# EAGLE design arm-board-rev3 (EAGLE 6.5.0)

## Sheet 1 of 6: Processor
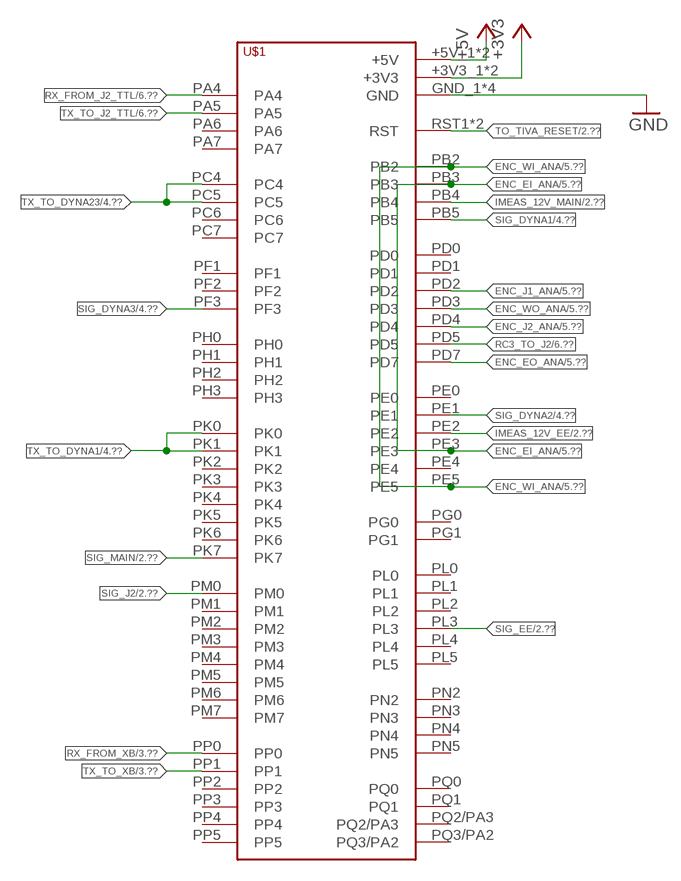
[diagram p0: schematic, sheet 1]

### Parts
U$1  TIVA-C-CONNECTED  [TIVA-C-CONNECTED]

### Nets
+3V3: U$1.+3V3_1(+3V3) U$1.+3V3_2(+3V3) ; also sheet 2,3,4,5
+5V: U$1.+5V_1(+5V) U$1.+5V_2(+5V) ; also sheet 2,5,6
ENC_EI_ANA: U$1.PB3 U$1.PE3 ; also sheet 5
ENC_EO_ANA: U$1.PD7 ; also sheet 5
ENC_J1_ANA: U$1.PD2 ; also sheet 5
ENC_J2_ANA: U$1.PD4 ; also sheet 5
ENC_WI_ANA: U$1.PB2 U$1.PE5 ; also sheet 5
ENC_WO_ANA: U$1.PD3 ; also sheet 5
GND: U$1.GND_1(GND) U$1.GND_2(GND) U$1.GND_3(GND) U$1.GND_4(GND) ; also sheet 2,3,4,5,6
IMEAS_12V_EE: U$1.PE2 ; also sheet 2
IMEAS_12V_MAIN: U$1.PB4 ; also sheet 2
RC3_TO_J2: U$1.PD5 ; also sheet 6
RX_FROM_J2_TTL: U$1.PA4 ; also sheet 6
RX_FROM_XB: U$1.PP0 ; also sheet 3
SIG_DYNA1: U$1.PB5 ; also sheet 4
SIG_DYNA2: U$1.PE1 ; also sheet 4
SIG_DYNA3: U$1.PF3 ; also sheet 4
SIG_EE: U$1.PL3 ; also sheet 2
SIG_J2: U$1.PM0 ; also sheet 2
SIG_MAIN: U$1.PK7 ; also sheet 2
TO_TIVA_RESET: U$1.RST1(RST) U$1.RST_2(RST) ; also sheet 2
TX_TO_DYNA1: U$1.PK0 U$1.PK1 ; also sheet 4
TX_TO_DYNA23: U$1.PC4 U$1.PC5 ; also sheet 4
TX_TO_J2_TTL: U$1.PA5 ; also sheet 6
TX_TO_XB: U$1.PP1 ; also sheet 3
Unconnected: U$1.PA6 U$1.PA7 U$1.PC6 U$1.PC7 U$1.PD0 U$1.PD1 U$1.PE0 U$1.PE4 U$1.PF1 U$1.PF2 U$1.PG0 U$1.PG1 U$1.PH0 U$1.PH1 U$1.PH2 U$1.PH3 U$1.PK2 U$1.PK3 U$1.PK4 U$1.PK5 U$1.PK6 U$1.PL0 U$1.PL1 U$1.PL2 U$1.PL4 U$1.PL5 U$1.PM1 U$1.PM2 U$1.PM3 U$1.PM4 U$1.PM5 U$1.PM6 U$1.PM7 U$1.PN2 U$1.PN3 U$1.PN4 U$1.PN5 U$1.PP2 U$1.PP3 U$1.PP4 U$1.PP5 U$1.PQ0 U$1.PQ1 U$1.PQ2/PA3 U$1.PQ3/PA2

## Sheet 2 of 6: Power
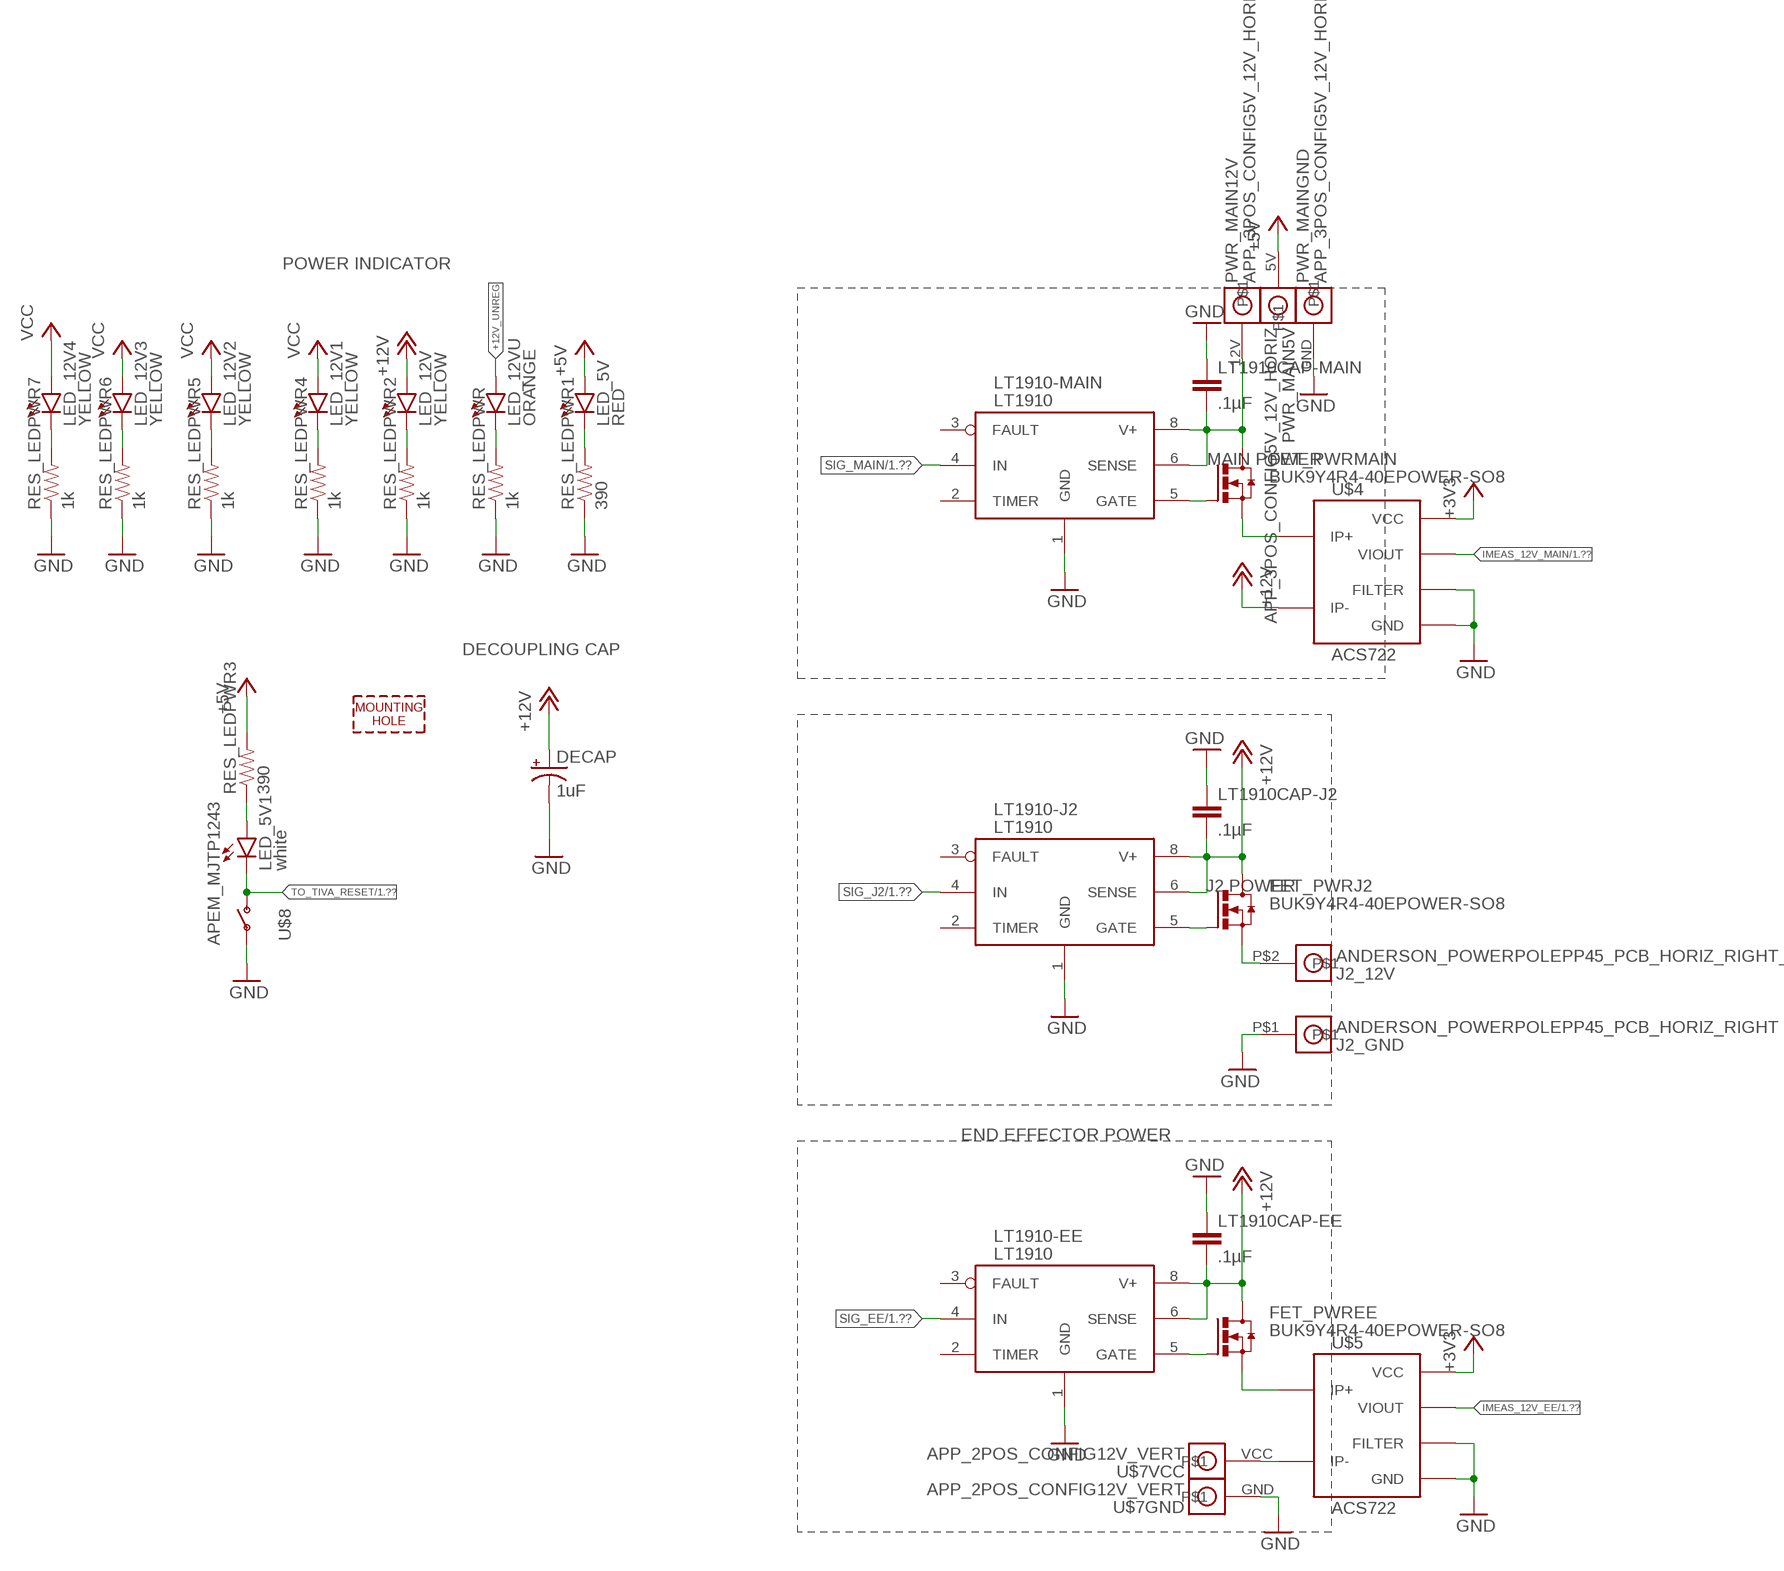
[diagram p1: schematic, sheet 2]

### Parts
DECAP  1uF  100UF-25V-20%(PTH)  [CPOL-RADIAL-100UF-25V]
FET_PWREE  BUK9Y4R4-40EPOWER-SO8  [POWER-SO8]
FET_PWRJ2  BUK9Y4R4-40EPOWER-SO8  [POWER-SO8]
FET_PWRMAIN  BUK9Y4R4-40EPOWER-SO8  [POWER-SO8]
J2_12V  ANDERSON_POWERPOLEPP45_PCB_HORIZ_RIGHT_2HIGH  [APP45_PCB_HORIZ_RIGHT_2HIGH]
J2_GND  ANDERSON_POWERPOLEPP45_PCB_HORIZ_RIGHT  [APP45_PCB_HORIZ_RIGHT]
LED_5V  RED  LED0603  [LED-0603]
LED_5V1  white  LED1206  [LED-1206]
LED_12V  YELLOW  LED0603  [LED-0603]
LED_12V1  YELLOW  LED0603  [LED-0603]
LED_12V2  YELLOW  LED0603  [LED-0603]
LED_12V3  YELLOW  LED0603  [LED-0603]
LED_12V4  YELLOW  LED0603  [LED-0603]
LED_12VU  ORANGE  LED0603  [LED-0603]
LT1910-EE  LT1910  [SO8]
LT1910-J2  LT1910  [SO8]
LT1910-MAIN  LT1910  [SO8]
LT1910CAP-EE  .1µF  CAP0603-CAP  [0603-CAP]
LT1910CAP-J2  .1µF  CAP0603-CAP  [0603-CAP]
LT1910CAP-MAIN  .1µF  CAP0603-CAP  [0603-CAP]
PWR_MAIN  APP_3POS_CONFIG5V_12V_HORIZ  [APP45_5V_12V_HORIZ_CONFIG]
RES_LEDPWR  1k  RESISTOR0603  [0603-RES]
RES_LEDPWR1  390  RESISTOR0603  [0603-RES]
RES_LEDPWR2  1k  RESISTOR0603  [0603-RES]
RES_LEDPWR3  390  RESISTOR0603  [0603-RES]
RES_LEDPWR4  1k  RESISTOR0603  [0603-RES]
RES_LEDPWR5  1k  RESISTOR0603  [0603-RES]
RES_LEDPWR6  1k  RESISTOR0603  [0603-RES]
RES_LEDPWR7  1k  RESISTOR0603  [0603-RES]
U$3  MOUNTING_HOLE#6  [#6_SCREW]
U$4  ACS722  [SO-08]
U$5  ACS722  [SO-08]
U$7  APP_2POS_CONFIG12V_VERT  [APP45_12V_VERT_CONFIG]
U$8  APEM_MJTP1243  [APEM_MJTP1243]

### Nets
+3V3: U$4.8(VCC) U$5.8(VCC) ; also sheet 1,3,4,5
+5V: LED_5V.A PWR_MAIN.5V RES_LEDPWR3.2 ; also sheet 1,5,6
+12V: DECAP.1(+) FET_PWREE.5(D) FET_PWREE.6(D) FET_PWREE.7(D) FET_PWREE.8(D) FET_PWRJ2.5(D) FET_PWRJ2.6(D) FET_PWRJ2.7(D) FET_PWRJ2.8(D) LED_12V.A LT1910-EE.6(SENSE) LT1910-EE.8(V+) LT1910-J2.6(SENSE) LT1910-J2.8(V+) LT1910CAP-EE.2 LT1910CAP-J2.2 U$4.3(IP-) U$4.4(IP-) ; also sheet 4
+12V_UNREG: FET_PWRMAIN.5(D) FET_PWRMAIN.6(D) FET_PWRMAIN.7(D) FET_PWRMAIN.8(D) LED_12VU.A LT1910-MAIN.6(SENSE) LT1910-MAIN.8(V+) LT1910CAP-MAIN.2 PWR_MAIN.12V
GATE-EE: FET_PWREE.4(G) LT1910-EE.5(GATE)
GATE-J2: FET_PWRJ2.4(G) LT1910-J2.5(GATE)
GATE-MAIN: FET_PWRMAIN.4(G) LT1910-MAIN.5(GATE)
GND: DECAP.2(-) J2_GND.P$1 LT1910-EE.1(GND) LT1910-J2.1(GND) LT1910-MAIN.1(GND) LT1910CAP-EE.1 LT1910CAP-J2.1 LT1910CAP-MAIN.1 PWR_MAIN.GND RES_LEDPWR1.1 RES_LEDPWR2.1 RES_LEDPWR4.1 RES_LEDPWR5.1 RES_LEDPWR6.1 RES_LEDPWR7.1 RES_LEDPWR.1 U$4.5(GND) U$4.6(FILTER) U$5.5(GND) U$5.6(FILTER) U$7.GND U$8.P$1(P) ; also sheet 1,3,4,5,6
IMEAS_12V_EE: U$5.7(VIOUT) ; also sheet 1
IMEAS_12V_MAIN: U$4.7(VIOUT) ; also sheet 1
N$4: LED_12V.C RES_LEDPWR2.2
N$5: LED_12VU.C RES_LEDPWR.2
N$6: LED_5V.C RES_LEDPWR1.2
N$7: LED_12V1.C RES_LEDPWR4.2
N$10: U$5.3(IP-) U$5.4(IP-) U$7.VCC
N$11: LED_5V1.A RES_LEDPWR3.1
N$12: LED_12V2.C RES_LEDPWR5.2
N$14: LED_12V3.C RES_LEDPWR6.2
N$15: LED_12V4.C RES_LEDPWR7.2
SIG_EE: LT1910-EE.4(IN) ; also sheet 1
SIG_J2: LT1910-J2.4(IN) ; also sheet 1
SIG_MAIN: LT1910-MAIN.4(IN) ; also sheet 1
SOURCE-DYNA1: LED_12V2.A ; supply symbol labelled VCC ; also sheet 4
SOURCE-DYNA2: LED_12V3.A ; supply symbol labelled VCC ; also sheet 4
SOURCE-DYNA3: LED_12V4.A ; supply symbol labelled VCC ; also sheet 4
SOURCE-EE: FET_PWREE.1(S) FET_PWREE.2(S) FET_PWREE.3(S) U$5.1(IP+) U$5.2(IP+)
SOURCE-J2: FET_PWRJ2.1(S) FET_PWRJ2.2(S) FET_PWRJ2.3(S) J2_12V.P$2 LED_12V1.A ; supply symbol labelled VCC
SOURCE-MAIN: FET_PWRMAIN.1(S) FET_PWRMAIN.2(S) FET_PWRMAIN.3(S) U$4.1(IP+) U$4.2(IP+)
TO_TIVA_RESET: LED_5V1.C U$8.P$2(S) ; also sheet 1
Unconnected: LT1910-EE.2(TIMER) LT1910-EE.3(FAULT) LT1910-J2.2(TIMER) LT1910-J2.3(FAULT) LT1910-MAIN.2(TIMER) LT1910-MAIN.3(FAULT)

### Notes on the sheet
- POWER INDICATOR
- MAIN POWER
- DECOUPLING CAP
- J2 POWER
- END EFFECTOR POWER

## Sheet 3 of 6: Xbee
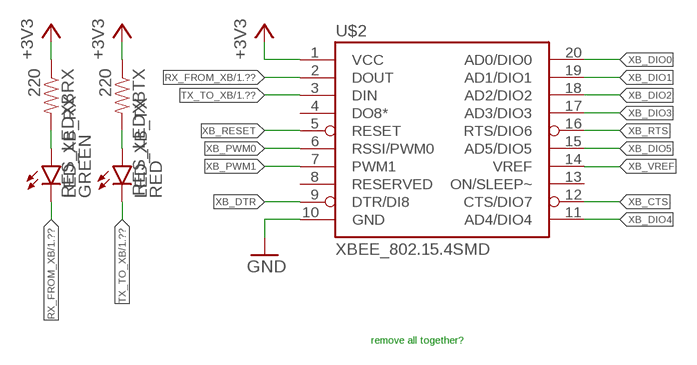
[diagram p2: schematic, sheet 3]

### Parts
LED_XB_RX  GREEN  LED0603  [LED-0603]
LED_XB_TX  RED  LED0603  [LED-0603]
RES_LEDXBRX  220  RESISTOR0603  [0603-RES]
RES_LEDXBTX  220  RESISTOR0603  [0603-RES]
U$2  XBEE_802.15.4SMD  [XBEE_802.15.4_SMD]

### Nets
+3V3: RES_LEDXBRX.1 RES_LEDXBTX.1 U$2.1(VCC) ; also sheet 1,2,4,5
GND: U$2.10(GND) ; also sheet 1,2,4,5,6
N$1: LED_XB_RX.A RES_LEDXBRX.2
N$2: LED_XB_TX.A RES_LEDXBTX.2
RX_FROM_XB: LED_XB_RX.C U$2.2(DOUT) ; also sheet 1
TX_TO_XB: LED_XB_TX.C U$2.3(DIN) ; also sheet 1
XB_CTS: U$2.12(CTS/DIO7)
XB_DIO0: U$2.20(AD0/DIO0)
XB_DIO1: U$2.19(AD1/DIO1)
XB_DIO2: U$2.18(AD2/DIO2)
XB_DIO3: U$2.17(AD3/DIO3)
XB_DIO4: U$2.11(AD4/DIO4)
XB_DIO5: U$2.15(AD5/DIO5)
XB_DTR: U$2.9(DTR/DI8)
XB_PWM0: U$2.6(RSSI/PWM0)
XB_PWM1: U$2.7(PWM1)
XB_RESET: U$2.5(RESET)
XB_RTS: U$2.16(RTS/DIO6)
XB_VREF: U$2.14(VREF)
Unconnected: U$2.4(DO8*) U$2.8(RESERVED) U$2.13(ON/SLEEP~)

### Notes on the sheet
- remove all together?

## Sheet 4 of 6: Dynamixels
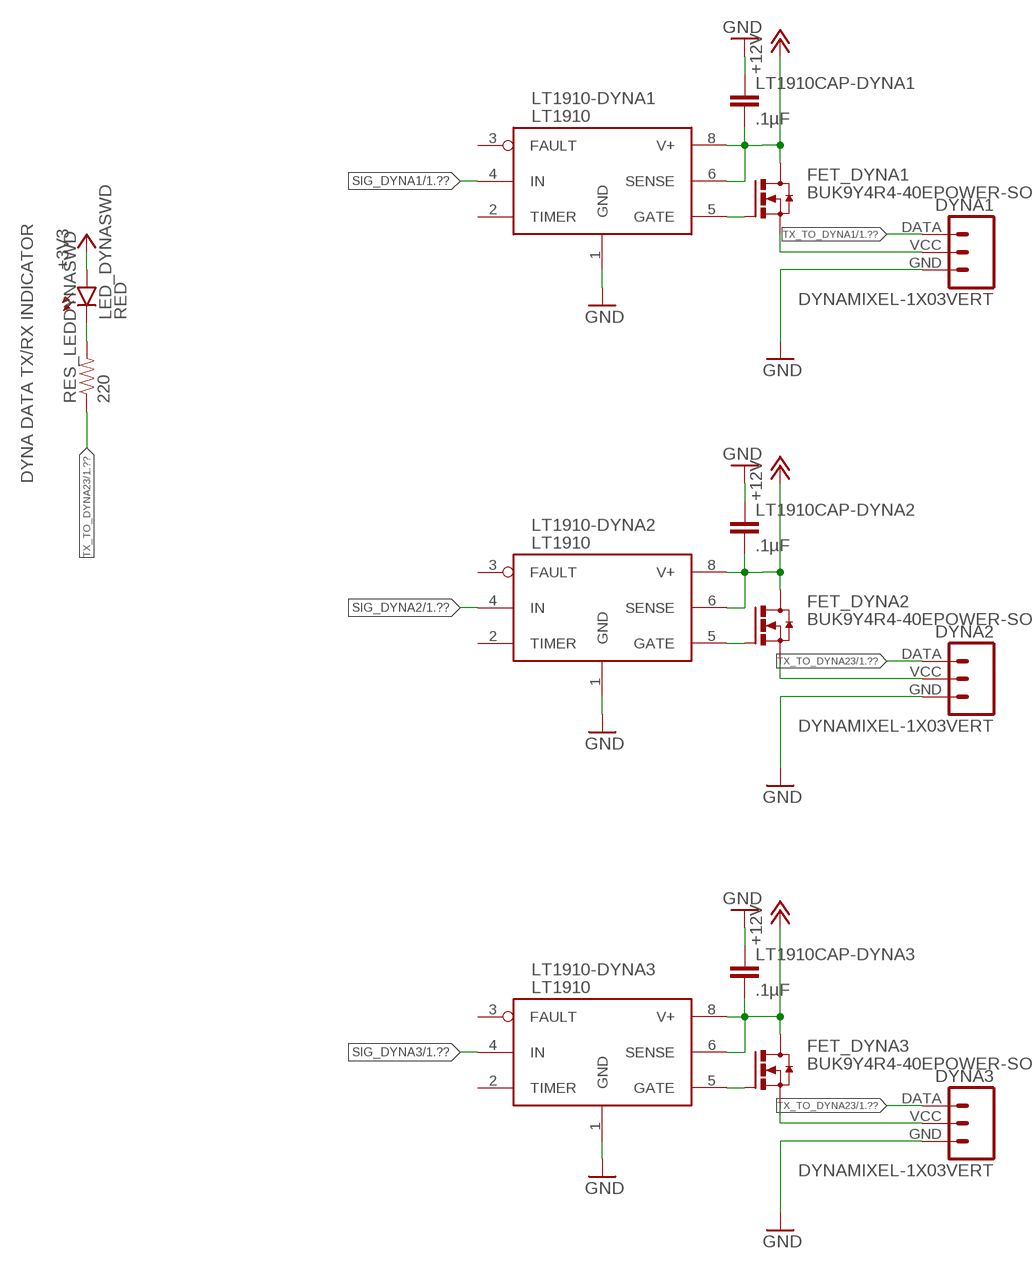
[diagram p3: schematic, sheet 4]

### Parts
DYNA1  DYNAMIXEL-1X03VERT  [MLX-SPOX5267-3PIN]
DYNA2  DYNAMIXEL-1X03VERT  [MLX-SPOX5267-3PIN]
DYNA3  DYNAMIXEL-1X03VERT  [MLX-SPOX5267-3PIN]
FET_DYNA1  BUK9Y4R4-40EPOWER-SO8  [POWER-SO8]
FET_DYNA2  BUK9Y4R4-40EPOWER-SO8  [POWER-SO8]
FET_DYNA3  BUK9Y4R4-40EPOWER-SO8  [POWER-SO8]
LED_DYNASWD  RED  LED0603  [LED-0603]
LT1910-DYNA1  LT1910  [SO8]
LT1910-DYNA2  LT1910  [SO8]
LT1910-DYNA3  LT1910  [SO8]
LT1910CAP-DYNA1  .1µF  CAP0603-CAP  [0603-CAP]
LT1910CAP-DYNA2  .1µF  CAP0603-CAP  [0603-CAP]
LT1910CAP-DYNA3  .1µF  CAP0603-CAP  [0603-CAP]
RES_LEDDYNASWD  220  RESISTOR0603  [0603-RES]

### Nets
+3V3: LED_DYNASWD.A ; also sheet 1,2,3,5
+12V: FET_DYNA1.5(D) FET_DYNA1.6(D) FET_DYNA1.7(D) FET_DYNA1.8(D) FET_DYNA2.5(D) FET_DYNA2.6(D) FET_DYNA2.7(D) FET_DYNA2.8(D) FET_DYNA3.5(D) FET_DYNA3.6(D) FET_DYNA3.7(D) FET_DYNA3.8(D) LT1910-DYNA1.6(SENSE) LT1910-DYNA1.8(V+) LT1910-DYNA2.6(SENSE) LT1910-DYNA2.8(V+) LT1910-DYNA3.6(SENSE) LT1910-DYNA3.8(V+) LT1910CAP-DYNA1.2 LT1910CAP-DYNA2.2 LT1910CAP-DYNA3.2 ; also sheet 2
GATE-DYNA1: FET_DYNA1.4(G) LT1910-DYNA1.5(GATE)
GATE-DYNA2: FET_DYNA2.4(G) LT1910-DYNA2.5(GATE)
GATE-DYNA3: FET_DYNA3.4(G) LT1910-DYNA3.5(GATE)
GND: DYNA1.GND DYNA2.GND DYNA3.GND LT1910-DYNA1.1(GND) LT1910-DYNA2.1(GND) LT1910-DYNA3.1(GND) LT1910CAP-DYNA1.1 LT1910CAP-DYNA2.1 LT1910CAP-DYNA3.1 ; also sheet 1,2,3,5,6
N$3: LED_DYNASWD.C RES_LEDDYNASWD.2
SIG_DYNA1: LT1910-DYNA1.4(IN) ; also sheet 1
SIG_DYNA2: LT1910-DYNA2.4(IN) ; also sheet 1
SIG_DYNA3: LT1910-DYNA3.4(IN) ; also sheet 1
SOURCE-DYNA1: DYNA1.VCC FET_DYNA1.1(S) FET_DYNA1.2(S) FET_DYNA1.3(S) ; also sheet 2
SOURCE-DYNA2: DYNA2.VCC FET_DYNA2.1(S) FET_DYNA2.2(S) FET_DYNA2.3(S) ; also sheet 2
SOURCE-DYNA3: DYNA3.VCC FET_DYNA3.1(S) FET_DYNA3.2(S) FET_DYNA3.3(S) ; also sheet 2
TX_TO_DYNA1: DYNA1.DATA ; also sheet 1
TX_TO_DYNA23: DYNA2.DATA DYNA3.DATA RES_LEDDYNASWD.1 ; also sheet 1
Unconnected: LT1910-DYNA1.2(TIMER) LT1910-DYNA1.3(FAULT) LT1910-DYNA2.2(TIMER) LT1910-DYNA2.3(FAULT) LT1910-DYNA3.2(TIMER) LT1910-DYNA3.3(FAULT)

### Notes on the sheet
- DYNA DATA TX/RX INDICATOR

## Sheet 5 of 6: Encoders
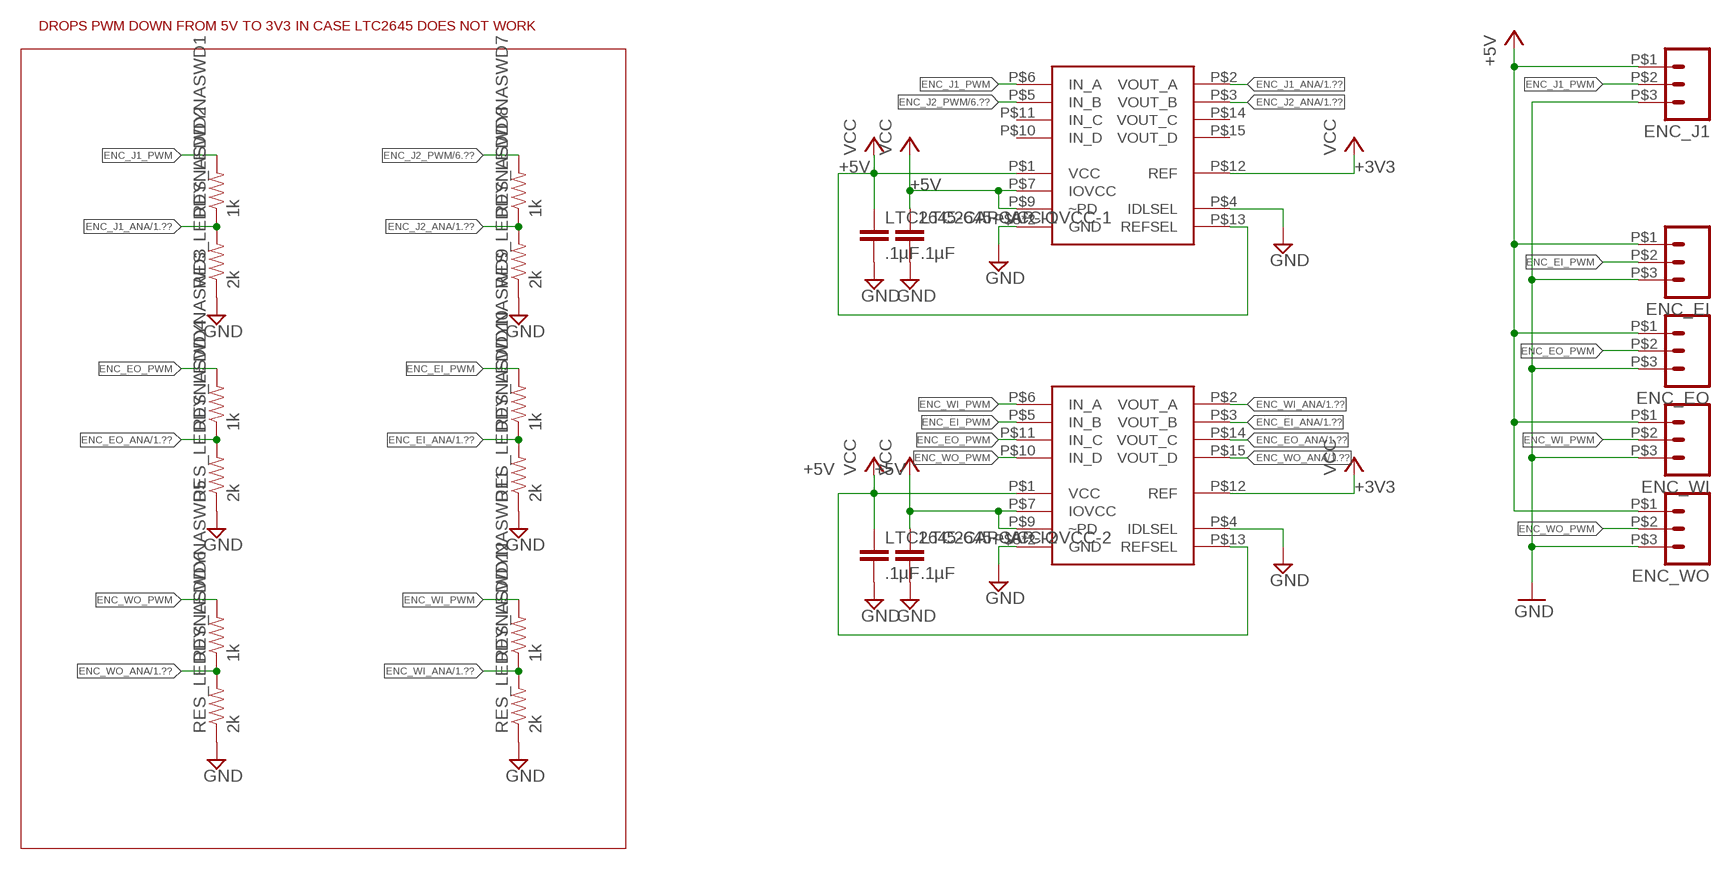
[diagram p4: schematic, sheet 5]

### Parts
ENC_EI  M03VERT  [MOLEX0436500328]
ENC_EO  M03VERT  [MOLEX0436500328]
ENC_J1  M03VERT  [MOLEX0436500328]
ENC_WI  M03VERT  [MOLEX0436500328]
ENC_WO  M03VERT  [MOLEX0436500328]
LTC2645-CAP-IOVCC-1  .1µF  CAP0603-CAP  [0603-CAP]
LTC2645-CAP-IOVCC-2  .1µF  CAP0603-CAP  [0603-CAP]
LTC2645-CAP-VCC-1  .1µF  CAP0603-CAP  [0603-CAP]
LTC2645-CAP-VCC-2  .1µF  CAP0603-CAP  [0603-CAP]
RES_LEDDYNASWD1  1k  RESISTOR0603  [0603-RES]
RES_LEDDYNASWD2  2k  RESISTOR0603  [0603-RES]
RES_LEDDYNASWD3  1k  RESISTOR0603  [0603-RES]
RES_LEDDYNASWD4  2k  RESISTOR0603  [0603-RES]
RES_LEDDYNASWD5  1k  RESISTOR0603  [0603-RES]
RES_LEDDYNASWD6  2k  RESISTOR0603  [0603-RES]
RES_LEDDYNASWD7  1k  RESISTOR0603  [0603-RES]
RES_LEDDYNASWD8  2k  RESISTOR0603  [0603-RES]
RES_LEDDYNASWD9  1k  RESISTOR0603  [0603-RES]
RES_LEDDYNASWD10  2k  RESISTOR0603  [0603-RES]
RES_LEDDYNASWD11  1k  RESISTOR0603  [0603-RES]
RES_LEDDYNASWD12  2k  RESISTOR0603  [0603-RES]
U$9  LTC2645  [MSOP16]
U$11  LTC2645  [MSOP16]

### Nets
+3V3: U$9.P$12(REF) U$11.P$12(REF) ; supply symbol labelled VCC ; also sheet 1,2,3,4
+5V: ENC_EI.P$1 ENC_EO.P$1 ENC_J1.P$1 ENC_WI.P$1 ENC_WO.P$1 LTC2645-CAP-IOVCC-1.1 LTC2645-CAP-IOVCC-2.1 LTC2645-CAP-VCC-1.1 LTC2645-CAP-VCC-2.1 U$9.P$1(VCC) U$9.P$7(IOVCC) U$9.P$9(~PD) U$9.P$13(REFSEL) U$11.P$1(VCC) U$11.P$7(IOVCC) U$11.P$9(~PD) U$11.P$13(REFSEL) ; supply symbol labelled VCC ; also sheet 1,2,6
ENC_EI_ANA: RES_LEDDYNASWD9.1 RES_LEDDYNASWD10.2 U$11.P$3(VOUT_B) ; also sheet 1
ENC_EI_PWM: ENC_EI.P$2 RES_LEDDYNASWD9.2 U$11.P$5(IN_B)
ENC_EO_ANA: RES_LEDDYNASWD3.1 RES_LEDDYNASWD4.2 U$11.P$14(VOUT_C) ; also sheet 1
ENC_EO_PWM: ENC_EO.P$2 RES_LEDDYNASWD3.2 U$11.P$11(IN_C)
ENC_J1_ANA: RES_LEDDYNASWD1.1 RES_LEDDYNASWD2.2 U$9.P$2(VOUT_A) ; also sheet 1
ENC_J1_PWM: ENC_J1.P$2 RES_LEDDYNASWD1.2 U$9.P$6(IN_A)
ENC_J2_ANA: RES_LEDDYNASWD7.1 RES_LEDDYNASWD8.2 U$9.P$3(VOUT_B) ; also sheet 1
ENC_J2_PWM: RES_LEDDYNASWD7.2 U$9.P$5(IN_B) ; also sheet 6
ENC_WI_ANA: RES_LEDDYNASWD11.1 RES_LEDDYNASWD12.2 U$11.P$2(VOUT_A) ; also sheet 1
ENC_WI_PWM: ENC_WI.P$2 RES_LEDDYNASWD11.2 U$11.P$6(IN_A)
ENC_WO_ANA: RES_LEDDYNASWD5.1 RES_LEDDYNASWD6.2 U$11.P$15(VOUT_D) ; also sheet 1
ENC_WO_PWM: ENC_WO.P$2 RES_LEDDYNASWD5.2 U$11.P$10(IN_D)
GND: ENC_EI.P$3 ENC_EO.P$3 ENC_J1.P$3 ENC_WI.P$3 ENC_WO.P$3 LTC2645-CAP-IOVCC-1.2 LTC2645-CAP-IOVCC-2.2 LTC2645-CAP-VCC-1.2 LTC2645-CAP-VCC-2.2 RES_LEDDYNASWD2.1 RES_LEDDYNASWD4.1 RES_LEDDYNASWD6.1 RES_LEDDYNASWD8.1 RES_LEDDYNASWD10.1 RES_LEDDYNASWD12.1 U$9.P$4(IDLSEL) U$9.P$8(GND) U$9.P$16(GND) U$11.P$4(IDLSEL) U$11.P$8(GND) U$11.P$16(GND) ; also sheet 1,2,3,4,6
Unconnected: U$9.P$10(IN_D) U$9.P$11(IN_C) U$9.P$14(VOUT_C) U$9.P$15(VOUT_D)

### Notes on the sheet
- DROPS PWM DOWN FROM 5V TO 3V3 IN CASE LTC2645 DOES NOT WORK

## Sheet 6 of 6: J2
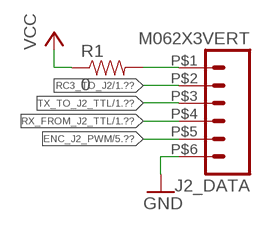
[diagram p5: schematic, sheet 6]

### Parts
J2_DATA  M062X3VERT  [MOLEX_0430450627]
R1  0  RESISTOR0603  [0603-RES]

### Nets
+5V: R1.1 ; supply symbol labelled VCC ; also sheet 1,2,5
ENC_J2_PWM: J2_DATA.P$5 ; also sheet 5
GND: J2_DATA.P$6 ; also sheet 1,2,3,4,5
N$13: J2_DATA.P$1 R1.2
RC3_TO_J2: J2_DATA.P$2 ; also sheet 1
RX_FROM_J2_TTL: J2_DATA.P$4 ; also sheet 1
TX_TO_J2_TTL: J2_DATA.P$3 ; also sheet 1

## Library data of the parts
DECAP = SparkFun-Capacitors:100UF-25V-20%(PTH): CAP-08439; PROD_ID: CAP-08439
DYNA1-DYNA3 = MRDT-2015-Arm:DYNAMIXEL-1X03; MFR: Molex; MFR_PN: 0022035035; ORIENT: Vert
ENC_EI ENC_EO ENC_J1 ENC_WI ENC_WO = MRDT-Connectors:M03
FET_DYNA1-FET_DYNA3 FET_PWREE FET_PWRJ2 FET_PWRMAIN = MRDT-2015-General:BUK9Y4R4-40E: Compatible with the BUK9Y** MOSFETS made by NXP Semiconductors.; MFR: NXP; MFR_PN: BUK9Y4R4-40E; PACKAGE: POWER-SO8
J2_12V J2_GND = MRDT-Connectors:ANDERSON_POWERPOLE: http://www.powerwerx.com/anderson-powerpoles/
J2_DATA = MRDT-Connectors:M06
LED_5V LED_5V1 LED_12V LED_12V1-LED_12V4 LED_12VU LED_DYNASWD LED_XB_RX LED_XB_TX = SparkFun-LED:LED: LEDs Standard schematic elements and footprints for 5mm, 3mm, 1206, and 0603 sized LEDs. 5mm - Spark Fun Electronics SKU : COM-00529 (and others)
LT1910-DYNA1-LT1910-DYNA3 LT1910-EE LT1910-J2 LT1910-MAIN = Jake:LT1910
LT1910CAP-DYNA1-LT1910CAP-DYNA3 LT1910CAP-EE LT1910CAP-J2 LT1910CAP-MAIN LTC2645-CAP-IOVCC-1 LTC2645-CAP-IOVCC-2 LTC2645-CAP-VCC-1 LTC2645-CAP-VCC-2 = SparkFun-Capacitors:CAP: Capacitor Standard 0603 ceramic capacitor, and 0.1" leaded capacitor.
PWR_MAIN = MRDT-Connectors:APP_3POS_CONFIG; COLOR1: YELLOW; COLOR2: RED; COLOR3: BLACK
R1 RES_LEDDYNASWD RES_LEDDYNASWD1-RES_LEDDYNASWD12 RES_LEDPWR RES_LEDPWR1-RES_LEDPWR7 RES_LEDXBRX RES_LEDXBTX = SparkFun-Resistors:RESISTOR: Resistor Basic schematic elements and footprints for 0603, 1206, and PTH resistors.
U$1 = MRDT-2015-General:TIVA-C-CONNECTED: TIVA C CONNECTED LAUNCHPAD
U$2 = MRDT-RF:XBEE_802.15.4
U$3 = MRDT-Hardware:MOUNTING_HOLE: Mounting hole for M6 bolt. Standard use mounting hole for: Tiva C Connected - M6 Anderson Powerpole Mounting Wing - M8 Most frame-mounted PCB's - M8
U$4 U$5 = MRDT-PowerICs:ACS722
U$7 = MRDT-Connectors:APP_2POS_CONFIG; COLOR1: YELLOW; COLOR2: BLACK
U$8 = MRDT-Electromechanical:APEM_MJTP1243
U$9 U$11 = MRDT-DigitalICs:LTC2645

## Board
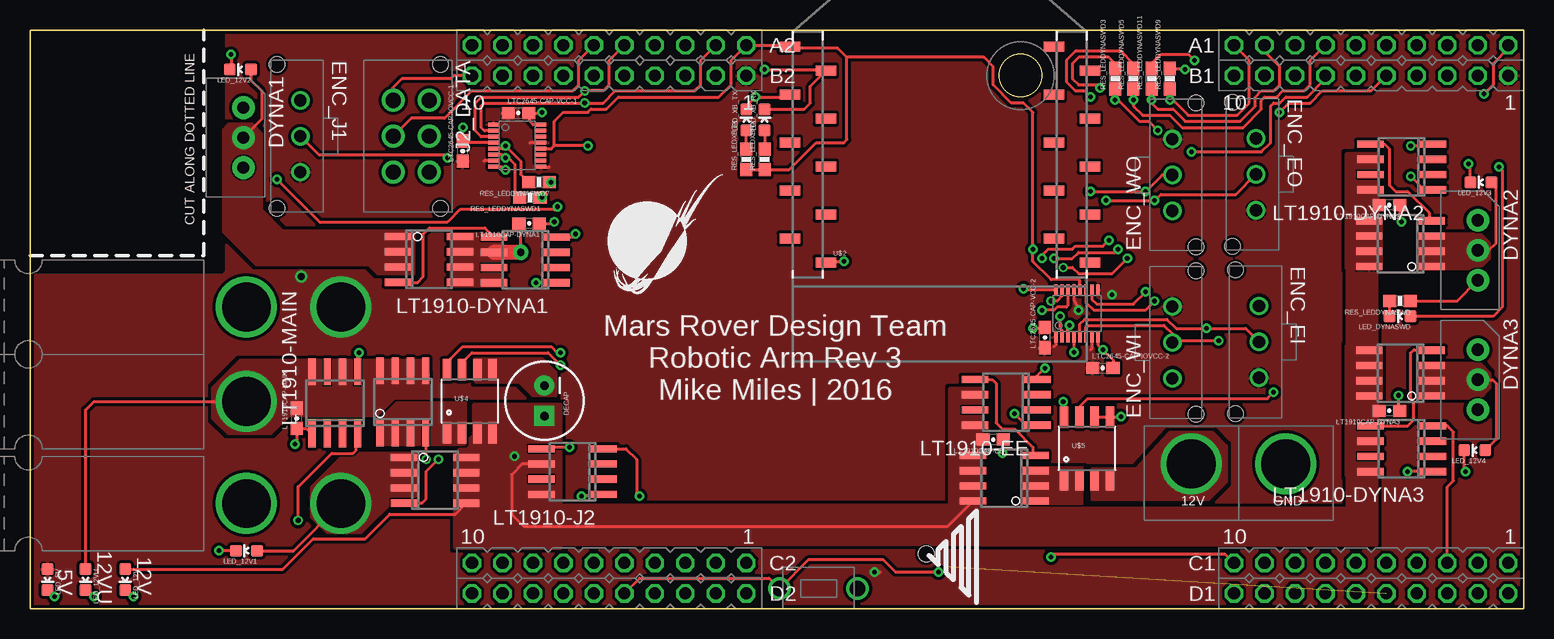
[diagram p6: board, top side]
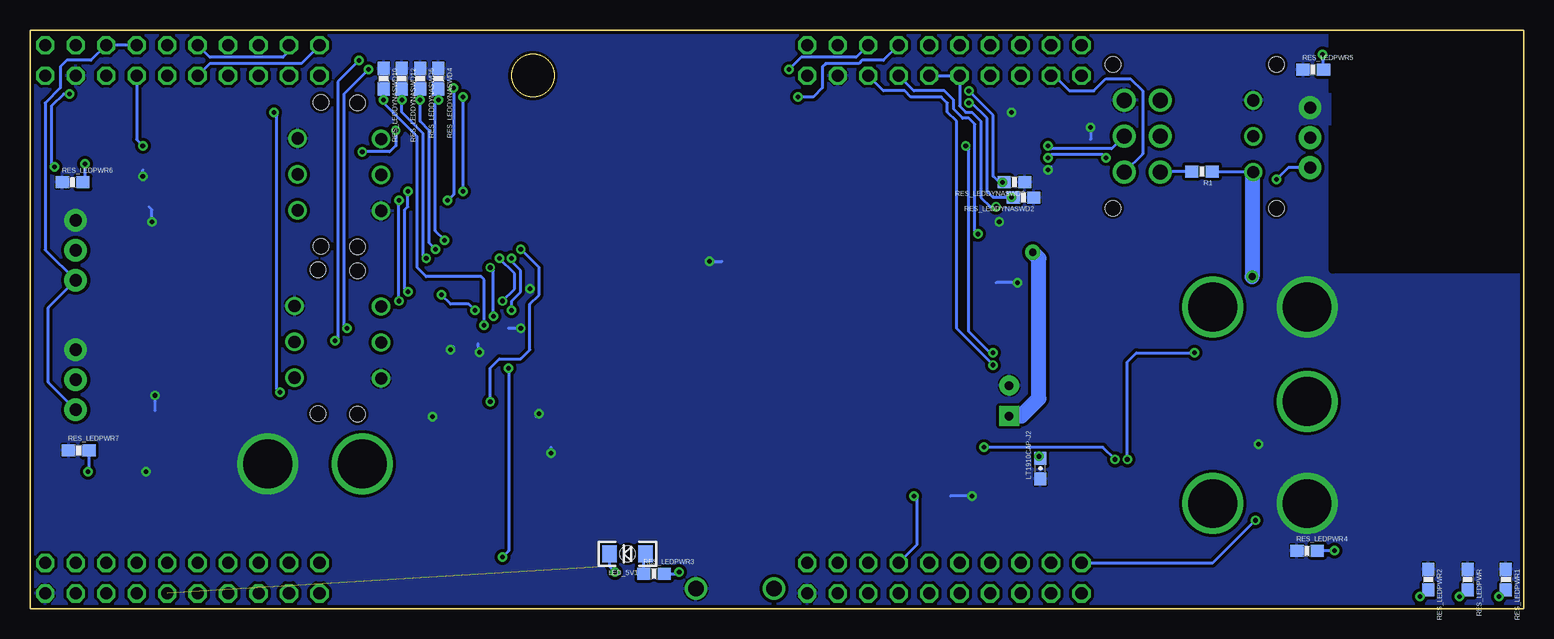
[diagram p7: board, bottom side, seen from below]

Size 124.46 x 48.26 mm. Coordinates in mm from the lower left corner, seen from the top.
Outline: 124.46,48.26 124.46,0 0,0 0,48.26 124.46,48.26
Copper layers (1*16): Top 0.035mm / dielectric 1.5mm / Bottom 0.035mm
Design rules "default *": minimum track width 10mil, minimum drill 15mil, track to track 5mil, track to pad 5mil, pad to pad 5mil, via to via 5mil, smd to smd 5mil, copper to edge 5mil, drill to drill 5mil, minimum pad ring 10mil, minimum via ring 8mil, stop-mask expansion 4mil, vias tented up to drill 0mil, thermal gap 5mil
Holes 1.3 mm at 74.68,4.57
tKeepout: area 0,28.3 to 15.9,48.3
bKeepout: area 0,28.3 to 15.9,48.3
tRestrict: area 0,28.3 to 15.9,48.3
bRestrict: area 0,28.3 to 15.9,48.3
vRestrict: area 0,28.3 to 15.9,48.3

### Footprints (pad centres in the part's own frame; a part is rotated, then mirrored left to right if it is on the bottom)
CPOL-RADIAL-100UF-25V = drill 0.7 pad 1.651 square: 1 1.27,0 | drill 0.7 pad 1.651: 2 -1.27,0
MLX-SPOX5267-3PIN = drill 1.016 pad 1.88: DATA 5,0; GND 0,0; VCC 2.5,0
MOLEX0436500328 = drill 1.016: P$1 9.322,2.464; P$2 6.325,2.464; P$3 3.327,2.464 | hole 1.27: 0.33,0.508; 12.319,0.508
POWER-SO8 = smd 0.6 x 2.2: 1 0.595,-0.6; 2 1.865,-0.6; 3 3.135,-0.6; 4 4.405,-0.6; 5 4.405,4.6; 6 3.135,4.6; 7 1.865,4.6; 8 0.595,4.6
APP45_PCB_HORIZ_RIGHT_2HIGH = drill 4.064: P$2 36.068,3.937
MOLEX_0430450627 = drill 1.27: P$1 9.322,2.464; P$2 6.325,2.464; P$3 3.327,2.464; P$4 9.322,5.461; P$5 6.325,5.461; P$6 3.327,5.461 | hole 1.27: 12.319,6.401; 0.33,6.401
APP45_PCB_HORIZ_RIGHT = drill 4.064: P$1 28.194,3.937
LED-0603 = smd 1 x 1: A 0,-0.877; C 0,0.877
LED-1206 = smd 1.2 x 1.4: A -1.5,0; C 1.5,0
SO8 = smd 0.6 x 2.2: 1 -1.905,-2.6; 2 -0.635,-2.6; 3 0.635,-2.6; 4 1.905,-2.6; 5 1.905,2.6; 6 0.635,2.6; 7 -0.635,2.6; 8 -1.905,2.6
0603-CAP = smd 1.1 x 1: 1 -0.85,0; 2 0.85,0
APP45_5V_12V_HORIZ_CONFIG = drill 4.064: 5V 36.068,11.811; 12V 28.194,3.937; GND 28.194,11.811
0603-RES = smd 1.1 x 1: 1 -0.85,0; 2 0.85,0
TIVA-C-CONNECTED = drill 1.016 octagon: +3V3_1 59.69,54.61; +3V3_2 123.19,54.61; +5V_1 59.69,52.07; +5V_2 123.19,52.07; GND_1 57.15,52.07; GND_2 59.69,8.89; GND_3 120.65,52.07; GND_4 123.19,8.89; PA4 39.37,52.07; PA5 36.83,52.07; PA6 105.41,52.07; PA7 52.07,8.89; PB2 102.87,54.61; PB3 100.33,54.61; PB4 54.61,52.07; PB5 52.07,52.07; PC4 118.11,54.61; PC5 115.57,54.61; PC6 113.03,54.61; PC7 105.41,54.61; PD0 107.95,8.89; PD1 110.49,8.89; PD2 57.15,54.61; PD3 107.95,54.61; PD4 49.53,54.61; PD5 46.99,54.61; PD7 107.95,52.07; PE0 118.11,52.07; PE1 115.57,52.07; PE2 113.03,52.07; PE3 110.49,52.07; PE4 120.65,54.61; PE5 110.49,54.61; PF1 123.19,11.43; PF2 120.65,11.43; PF3 118.11,11.43; PG0 115.57,11.43; PG1 59.69,11.43; PH0 44.45,11.43; PH1 41.91,11.43; PH2 118.11,8.89; PH3 115.57,8.89; PK0 49.53,52.07; PK1 46.99,52.07; PK2 44.45,52.07; PK3 41.91,52.07; PK4 57.15,11.43; PK5 54.61,11.43; PK6 39.37,11.43; PK7 36.83,11.43; PL0 107.95,11.43; PL1 105.41,11.43; PL2 102.87,11.43; PL3 100.33,11.43; PL4 113.03,11.43; PL5 110.49,11.43; PM0 52.07,11.43; PM1 49.53,11.43; PM2 46.99,11.43; PM3 120.65,8.89; PM4 102.87,52.07; PM5 100.33,52.07; PM6 36.83,8.89; PM7 57.15,8.89; PN2 105.41,8.89; PN3 102.87,8.89; PN4 36.83,54.61; PN5 39.37,54.61; PP0 54.61,54.61; PP1 52.07,54.61; PP2 100.33,8.89; PP3 41.91,8.89; PP4 41.91,54.61; PP5 54.61,8.89; PQ0 44.45,54.61; PQ1 39.37,8.89; PQ2/PA3 46.99,8.89; PQ3/PA2 44.45,8.89; RST1 49.53,8.89; RST_2 113.03,8.89
XBEE_802.15.4_SMD = smd 1.7 x 0.85: 1 -13.77,20; 2 -10.77,18; 3 -13.77,16; 4 -10.77,14; 5 -13.77,12; 6 -10.77,10; 7 -13.77,8; 8 -10.77,6; 9 -13.77,4; 10 -10.77,2; 11 11.23,2; 12 8.23,4; 13 11.23,6; 14 8.23,8; 15 11.23,10; 16 8.23,12; 17 11.23,14; 18 8.23,16; 19 11.23,18; 20 8.23,20
SO-08 = smd 0.711 x 1.778: 1 0.457,-0.813; 2 1.727,-0.813; 3 2.997,-0.813; 4 4.267,-0.813; 5 4.267,4.419; 6 2.997,4.419; 7 1.727,4.419; 8 0.457,4.419
APP45_12V_VERT_CONFIG = drill 4.064: GND 4.699,3.937; VCC 4.699,11.811
APEM_MJTP1243 = drill 1.27: P$1 -0.254,1.753; P$2 6.248,1.753
MSOP16 = smd 0.305 x 0.889: P$1 0.279,-0.476; P$2 0.78,-0.476; P$3 1.28,-0.476; P$4 1.781,-0.476; P$5 2.281,-0.476; P$6 2.781,-0.476; P$7 3.282,-0.476; P$8 3.782,-0.476; P$9 3.782,3.473; P$10 3.282,3.473; P$11 2.781,3.473; P$12 2.281,3.473; P$13 1.781,3.473; P$14 1.28,3.473; P$15 0.78,3.473; P$16 0.279,3.473

### Placement (x,y rotation side)
DECAP  42.86,17.34 270 top
DYNA1  17.78,41.78 270 top
DYNA2  120.65,32.38 270 top
DYNA3  120.65,21.59 270 top
ENC_EI  99.95,28.57 270 top
ENC_EO  99.69,42.55 270 top
ENC_J1  20.07,45.72 270 top
ENC_WI  97.66,15.88 90 top
ENC_WO  97.66,29.84 90 top
FET_DYNA1  31.24,31.62 270 top
FET_DYNA2  116.2,27.94 90 top
FET_DYNA3  116.2,17.14 90 top
FET_PWREE  83.19,8.38 90 top
FET_PWRJ2  31.75,13.21 270 top
FET_PWRMAIN  28.57,15.24 0 top
J2_12V  -10.16,4.83 0 top
J2_DATA  27.81,45.72 270 top
J2_GND  -10.16,4.83 0 top
LED_5V  1.46,2.41 180 top
LED_5V1  74.68,4.57 180 bottom
LED_12V  7.94,2.41 180 top
LED_12V1  18.03,4.83 90 top
LED_12V2  17.53,44.96 90 top
LED_12V3  120.9,35.56 90 top
LED_12V4  120.4,13.21 90 top
LED_12VU  4.64,2.41 180 top
LED_DYNASWD  114.17,24.38 90 top
LED_XB_RX  61.21,40.77 0 top
LED_XB_TX  59.69,40.77 0 top
LT1910-DYNA1  41.27,29.08 90 top
LT1910-DYNA2  114.3,36.83 90 top
LT1910-DYNA3  114.3,13.34 90 top
LT1910-EE  81.34,17.21 90 top
LT1910-J2  45.21,11.43 90 top
LT1910-MAIN  25.4,17.14 0 top
LT1910CAP-DYNA1  41.59,32.13 180 top
LT1910CAP-DYNA2  113.28,33.66 180 top
LT1910CAP-DYNA3  113.28,16.51 180 top
LT1910CAP-EE  80.26,14.1 180 top
LT1910CAP-J2  40.26,11.68 90 bottom
LT1910CAP-MAIN  22.23,15.88 90 top
LTC2645-CAP-IOVCC-1  36.07,38.16 90 top
LTC2645-CAP-IOVCC-2  89.41,20.07 0 top
LTC2645-CAP-VCC-1  40.7,41.34 0 top
LTC2645-CAP-VCC-2  84.58,22.61 90 top
PWR_MAIN  -10.16,13.34 0 top
R1  26.8,36.45 180 bottom
RES_LEDDYNASWD  114.17,25.65 180 top
RES_LEDDYNASWD1  41.66,34.29 180 top
RES_LEDDYNASWD2  41.66,34.29 180 bottom
RES_LEDDYNASWD3  90.42,44.2 90 top
RES_LEDDYNASWD4  90.42,44.2 270 bottom
RES_LEDDYNASWD5  91.95,44.2 90 top
RES_LEDDYNASWD6  91.95,44.2 270 bottom
RES_LEDDYNASWD7  42.42,35.56 180 top
RES_LEDDYNASWD8  42.42,35.56 180 bottom
RES_LEDDYNASWD9  95,44.2 90 top
RES_LEDDYNASWD10  95,44.2 270 bottom
RES_LEDDYNASWD11  93.47,44.2 90 top
RES_LEDDYNASWD12  93.47,44.2 270 bottom
RES_LEDPWR  4.64,2.41 270 bottom
RES_LEDPWR1  1.46,2.41 270 bottom
RES_LEDPWR2  7.94,2.41 270 bottom
RES_LEDPWR3  72.45,2.92 0 bottom
RES_LEDPWR4  18.03,4.83 0 bottom
RES_LEDPWR5  17.53,44.96 0 bottom
RES_LEDPWR6  120.9,35.56 0 bottom
RES_LEDPWR7  120.4,13.21 0 bottom
RES_LEDXBRX  61.21,37.47 90 top
RES_LEDXBTX  59.69,37.47 90 top
U$1  0,-7.62 0 top
U$2  77.09,26.86 0 top
U$3  82.55,44.45 0 top
U$4  34.29,15.49 0 top
U$5  85.72,11.56 0 top
U$6  [MRDT_LOGO]  48.13,25.4 0 top
U$7  108.58,7.37 90 top
U$8  68.71,3.43 180 top
U$9  39.12,40.64 270 top
U$11  85.22,23.11 0 top

### Tracks (layer width: path | path; a pad name or v marks a point on that pad's centre or on a via)
+3V3  (via drill 0.38)
  Top 0.254: RES_LEDXBTX.1 RES_LEDXBRX.1 63.28,36.62 65.53,38.86 67.82,38.86 68.07,39.12 68.07,45.97 | 68.07,45.97 67.31,46.74 63.44,46.74 U$2.1 63.19,46.99 U$1.+3V3_1 58.42,45.72 58.42,43.69 57.4,42.67 49.02,42.67 48.01,41.66 46.74,41.66 46.48,41.4 44.45,41.4 43.69,40.64 43.69,38.61 | U$9.P$12 43.44,38.36 43.69,38.61 | U$4.8 34.75,20.52 36.07,21.84 43.43,21.84 43.94,21.34 v44.2,21.34 | v46.48,38.61 43.69,38.61 | U$11.P$12 87.5,27.31 87.38,27.43 85.09,27.43 83.57,28.96 v83.57,29.97 83.57,41.4 82.8,42.16 81.79,42.16 80.26,43.69 80.26,45.21 79.5,45.97 68.07,45.97 | U$5.8 86.11,16.05 v86.11,17.27 | U$1.+3V3_2 123.19,46.74 121.92,45.47 121.92,43.69 v121.16,42.93 | v122.43,36.83 122.68,36.58 122.68,25.15 121.92,24.38 LED_DYNASWD.A
  Bottom 0.254: v44.2,21.34 44.45,21.34 46.23,23.11 46.23,38.35 v46.48,38.61 | v86.11,17.27 86.11,20.07 85.34,20.83 83.57,20.83 82.8,21.59 82.8,25.4 82.04,26.16 82.04,28.45 v83.57,29.97 | v121.16,42.93 121.67,42.93 122.68,41.91 122.68,37.08 v122.43,36.83
+5V  (via drill 0.38, 0.6)
  Top 0.254: v70.36,3.05 70.87,3.05 | U$11.P$13 87,25.78 v87.38,24.89 | v90.17,26.16 90.17,26.42 | U$11.P$1 85.5,22 85.34,21.84 | U$11.P$7 88.5,21.7 88.39,21.59 | U$9.P$13 41.66,38.86 | 42.55,36.83 43.31,36.83 | U$9.P$7 37.85,37.36 37.85,37.34
  Bottom 0.254: R1.1 22.58,36.45 ENC_J1.P$1 22.61,36.32 | RES_LEDPWR3.2 70.48,2.92 v70.36,3.05 | v87.38,24.89 87.88,25.4 89.41,25.4 v90.17,26.16
  Bottom 1.27: 22.61,36.32 v22.61,27.69
  pour Top (isolate 0.254, rank 6): -3.17,-11.43 130.81,-11.43 130.81,52.7 -3.17,52.7
+12V  (via drill 0.38, 0.6 pad 1.27)
  Top 0.254: v40.89,29.72 40.89,31.98 LT1910CAP-DYNA1.2 | LED_12V.A 21.07,3.29 23.62,5.84 27.94,5.84 29.97,7.87 35.42,7.87 FET_PWRJ2.5 | LT1910-J2.6 41.02,12.06 40.13,11.18 40.13,7.87 41.15,6.86 76.47,6.86 FET_PWREE.8
  Top 1.27: v40.89,29.72 LT1910-DYNA1.6
  Bottom 0.254: LT1910CAP-J2.2 40.22,12.53 v40.39,12.7
  Bottom 1.27: v40.89,29.72 40.39,29.21 40.39,17.53 41.85,16.07 DECAP.1
  pour Top (no thermals): 110.68,32.51 110.68,28.38 112.59,28.38 112.59,32.51
  pour Top (no thermals): 110.62,21.72 110.62,17.59 112.59,17.59 112.59,21.72
  pour Top (rank 2, no thermals): 35.37,5.08 44.26,5.08 44.26,17.02 36.96,17.02 36.96,14.48 35.37,12.89
  pour Top (no thermals): 79.25,18.29 76.71,18.29 76.71,8.64 79.25,8.64
  pour Top (no thermals): 112.27,37.85 109.73,37.85 109.73,28.45 112.27,28.45
  pour Top (no thermals): 112.27,21.84 109.73,21.84 109.73,11.18 112.27,11.18
  pour Top (no thermals): 35.05,31.24 35.05,26.92 39.37,26.92 39.37,31.24
  pour Top: 43.94,5.33 43.94,8.64 45.97,8.64 63.5,8.64 79.25,8.64 79.25,7.11 79.25,5.33
  pour Top (rank 2): 79.25,5.33 112.27,5.33 112.27,11.18 112.27,26.92 112.27,37.85 109.73,37.85 109.73,11.18 109.73,8.38 79.25,8.38
+12V_UNREG
  Top 0.254: LED_12VU.A 4.64,16.57 5.33,17.27 PWR_MAIN.12V
  pour Top (rank 5, no thermals): 33.15,20.7 17.53,20.7 15.24,18.41 15.24,15.88 16.51,14.61 20.07,14.61 21.59,16.13 33.21,16.13
ENC_EI_ANA  (via drill 0.38)
  Top 0.254: U$11.P$3 86.5,23.5 v86.61,23.62 | RES_LEDDYNASWD9.1 v95,42.42 95.25,42.42 96.52,41.15 100.58,41.15 101.6,42.16 101.6,45.72 U$1.PB3
  Bottom 0.254: RES_LEDDYNASWD9.1 v95,42.42 95,42.16 92.2,39.37 92.2,28.45 91.44,27.69 86.87,27.69 86.61,27.43 v86.61,23.62 | U$1.PB3 101.85,45.47 109.47,45.47 U$1.PE3
ENC_EI_PWM  (via drill 0.38)
  Top 0.254: U$11.P$5 87.5,23.74 87.88,24.13 94.74,24.13 95.5,23.37 v98.04,23.37 101.3,23.37 ENC_EI.P$2 | RES_LEDDYNASWD9.2 96.18,45.05 v96.27,44.96
  Bottom 0.254: v96.27,44.96 98.3,42.93 98.3,23.62 v98.04,23.37
ENC_EO_ANA  (via drill 0.38)
  Top 0.254: RES_LEDDYNASWD3.1 v90.42,42.42 90.68,42.42 92.46,40.64 93.22,40.64 v93.98,39.88 | U$11.P$14 86.5,25.28 86.36,25.15 85.6,25.15 85.34,24.89 v84.33,24.89 | v84.33,29.21 84.33,29.46 84.84,29.97 86.87,29.97 87.12,30.23 89.41,30.23 v89.92,30.73 | v96.77,38.1 102.62,38.1 103.38,38.86 103.38,41.91 103.63,42.16 104.14,42.16 104.65,42.67 106.43,42.67 107.95,44.2 U$1.PD7
  Bottom 0.254: RES_LEDDYNASWD3.1 v90.42,42.42 90.68,42.16 90.68,31.5 v89.92,30.73 | v84.33,24.89 84.33,25.65 83.57,26.42 83.57,28.19 84.33,28.96 v84.33,29.21 | v93.98,39.88 93.98,38.61 94.49,38.1 v96.77,38.1
ENC_EO_PWM  (via drill 0.38)
  Top 0.254: U$11.P$11 88,25.54 88.65,24.89 92.96,24.89 v93.73,25.65 | ENC_EO.P$2 100.48,34.54 94.23,34.54 v93.73,34.04 v89.66,34.04 | RES_LEDDYNASWD3.2 90.42,45.47 89.92,45.97 87.38,45.97 86.87,45.47 86.87,44.2 87.38,43.69 88.9,43.69 v89.15,43.43
  Bottom 0.254: v93.73,25.65 v93.73,34.04 | v89.15,43.43 89.15,34.54 v89.66,34.04
ENC_J1_ANA  (via drill 0.38)
  Top 0.254: U$9.P$2 37.86,39.86 37.59,40.13 37.59,41.91 37.85,42.16 v46.23,42.16 47.75,42.16 48.77,43.18 55.37,43.18 55.88,43.69 55.88,45.72 U$1.PD2 | RES_LEDDYNASWD1.1 v42.67,34.29
  Bottom 0.254: v42.67,34.29 RES_LEDDYNASWD1.1 44.2,34.29 44.7,34.8 44.7,40.89 45.97,42.16 v46.23,42.16
ENC_J1_PWM  (via drill 0.38)
  Top 0.254: ENC_J1.P$2 24.08,37.85 34.54,37.85 v34.8,37.59 | U$9.P$6 38.65,37.85 39.37,37.85 v39.62,37.59 39.88,37.59 40.39,37.08 40.39,34.71 RES_LEDDYNASWD1.2
  Bottom 0.254: v34.8,37.59 35.05,37.85 39.37,37.85 v39.62,37.59
ENC_J2_ANA  (via drill 0.38)
  Top 0.254: U$9.P$3 37.6,39.36 37.08,39.88 37.08,42.16 37.59,42.67 45.72,42.67 v46.23,43.18 47.75,43.18 48.26,43.69 48.26,45.72 U$1.PD4 | RES_LEDDYNASWD8.2 v43.43,35.56
  Bottom 0.254: v43.43,35.56 RES_LEDDYNASWD8.2 43.69,35.56 44.2,36.07 44.2,41.15 v46.23,43.18
ENC_J2_PWM  (via drill 0.38)
  Top 0.254: U$9.P$5 39.37,38.36 v39.62,38.61 40.89,37.34 40.89,36.23 RES_LEDDYNASWD7.2
  Bottom 0.254: J2_DATA.P$5 34.31,38.35 39.37,38.35 v39.62,38.61
ENC_WI_ANA  (via drill 0.38)
  Top 0.254: U$11.P$2 86,23.22 85.85,23.37 v85.85,24.38 | v91.44,29.21 90.17,27.94 87.38,27.94 86.87,28.45 v86.11,28.45 | RES_LEDDYNASWD11.1 v93.47,42.42 93.47,42.16 93.98,41.66 95.25,41.66 96.27,40.64 100.84,40.64 102.11,41.91 102.11,42.67 102.62,43.18 103.63,43.18 104.14,43.69 104.14,45.21 102.87,46.48 U$1.PB2
  Bottom 0.254: RES_LEDDYNASWD11.1 v93.47,42.42 93.47,41.4 91.69,39.62 91.69,29.46 v91.44,29.21 | v85.85,24.38 85.85,28.19 v86.11,28.45 | U$1.PB2 102.87,46.48 103.38,45.97 109.47,45.97 U$1.PE5
ENC_WI_PWM  (via drill 0.38)
  Top 0.254: U$11.P$6 88,23.48 88.14,23.62 94.49,23.62 95.25,22.86 95.25,22.35 | 95.25,22.35 95.25,22.25 ENC_WI.P$2 | 95.25,22.35 v99.06,22.35 | RES_LEDDYNASWD11.2 93.56,44.96 93.56,45.55 94.23,46.23 96.52,46.23 v97.03,45.72
  Bottom 0.254: v97.03,45.72 98.81,43.94 98.81,22.61 v99.06,22.35
ENC_WO_ANA  (via drill 0.38)
  Top 0.254: U$11.P$15 86,26.05 85.6,25.65 v85.09,25.65 | v85.34,29.21 86.87,29.21 87.38,29.72 90.42,29.72 v90.68,29.97 | RES_LEDDYNASWD5.1 v91.95,42.42 91.95,41.91 92.71,41.15 95,41.15 96.01,40.13 101.09,40.13 102.62,41.66 102.62,42.42 102.87,42.67 103.89,42.67 104.39,43.18 106.17,43.18 106.68,43.69 106.68,45.72 U$1.PD3
  Bottom 0.254: RES_LEDDYNASWD5.1 v91.95,42.42 91.95,40.64 91.19,39.88 91.19,30.48 v90.68,29.97 | v85.09,25.65 84.07,26.67 84.07,27.94 v85.34,29.21
ENC_WO_PWM  (via drill 0.38)
  Top 0.254: U$11.P$10 88.5,25.8 88.9,25.4 91.95,25.4 v92.96,26.42 | RES_LEDDYNASWD5.2 91.95,45.47 90.93,46.48 87.12,46.48 86.36,45.72 86.36,43.94 87.12,43.18 87.88,43.18 v88.39,42.67 | v88.39,34.8 v92.96,34.8 94.34,36.17 ENC_WO.P$2
  Bottom 0.254: v92.96,26.42 93.22,26.67 93.22,33.27 92.96,33.53 v92.96,34.8 | v88.39,42.67 v88.39,34.8
GATE-DYNA1
  Top 0.254: FET_DYNA1.4 32.3,27.22 32.77,27.69 32.77,31.24 33.27,31.75 37.91,31.75 LT1910-DYNA1.5
GATE-DYNA2
  Top 0.254: LT1910-DYNA2.5 112.9,38.73 113.28,38.35 113.28,35.31 113.79,34.8 114.81,34.8 116.59,33.02 116.59,32.56 FET_DYNA2.4
GATE-DYNA3
  Top 0.254: LT1910-DYNA3.5 114.81,15.24 115.32,15.75 115.32,17.27 115.06,17.53 115.06,21.34 115.32,21.59 116.77,21.59 FET_DYNA3.4
GATE-EE
  Top 0.254: LT1910-EE.5 80.2,19.11 80.52,18.8 80.52,15.49 81.03,14.99 82.04,14.99 83.57,13.46 83.57,13.01 FET_PWREE.4
GATE-J2  (via drill 0.38)
  Top 0.254: FET_PWRJ2.4 32.68,8.8 33.02,9.14 33.02,11.43 v34.04,12.45 | v44.96,13.46 42.74,13.46 LT1910-J2.5
  Bottom 0.254: v34.04,12.45 35.05,13.46 v44.96,13.46
GATE-MAIN  (via drill 0.38)
  Top 0.254: LT1910-MAIN.5 27.3,21.21 v27.43,21.34 | v33.02,12.45 33.02,14.6 FET_PWRMAIN.4
  Bottom 0.254: v33.02,12.45 33.02,20.57 32.26,21.34 v27.43,21.34
GND  (via drill 0.38)
  Top 0.254: LT1910CAP-EE.1 81.03,14.1 v81.03,12.95 | LT1910-EE.1 83,15.3 v82.04,16.26 | LT1910-DYNA3.1 v114.81,11.43 | LT1910CAP-DYNA3.1 114.05,16.42 v114.05,17.78 | LT1910CAP-DYNA2.1 114.13,32.35 v114.3,32.26 | LT1910-DYNA2.1 116.2,34.92 v115.06,36.07 | LTC2645-CAP-VCC-1.2 41.61,41.34 | LTC2645-CAP-VCC-1.2 42.61,41.34 v42.67,41.4 | LTC2645-CAP-IOVCC-1.2 36.22,38.86 U$9.P$4 36.07,38.86 v36.07,40.13 | U$9.P$16 41.94,40.36 41.66,40.64 41.66,41.24 LTC2645-CAP-VCC-1.2 | U$9.P$8 39.34,36.86 v39.62,36.58 | LT1910CAP-DYNA1.1 43.56,32.13 v43.69,32.26 | LT1910-DYNA1.1 v42.16,27.18 | LT1910-MAIN.1 23.02,15.03 LT1910CAP-MAIN.1 22.23,13.84 v22.1,13.72 | LT1910-J2.1 47.69,9.4 v45.97,9.4 | U$11.P$4 v87,21.4 | U$11.P$8 89,22 v89.41,21.59 90.26,20.74 LTC2645-CAP-IOVCC-2.2 | U$11.P$16 82.89,26.59 v82.8,26.67 | U$5.6 U$5.5 90.02,16 v90.93,16 | LTC2645-CAP-VCC-2.2 84.49,23.37 v83.57,23.37 | U$2.10 66.42,28.96 v67.82,28.96
  Bottom 0.254: v81.03,12.95 81.03,13.46 | v82.04,16.26 82.3,16 | v114.81,11.43 114.81,11.68 | v114.05,17.78 114.05,16.51 | v114.3,32.26 114.3,33.27 114.55,33.53 | v115.06,36.07 115.06,36.58 | v36.07,40.13 36.07,39.12 | v39.62,36.58 39.37,36.83 | v43.69,32.26 43.43,32.26 | v42.16,27.18 43.94,27.18 | v22.1,13.72 22.1,13.97 | v45.97,9.4 47.75,9.4 | v87,21.4 87.12,21.91 87.12,22.1 | v89.41,21.59 89.15,21.84 | v82.8,26.67 82.8,26.42 | v90.93,16 90.68,16 | v83.57,23.37 84.58,23.37 | v67.82,28.96 66.8,28.96
  pour Bottom (isolate 0.254, rank 6): -8.89,50.16 -8.89,-15.24 127,-15.24 127,50.16
  pour Top (no thermals): 37.15,20.83 37.15,18.92 40.77,18.92 41.91,17.78 43.81,17.78 43.81,19.68 42.67,20.83
  pour Bottom (no thermals): 119.13,22.86 119.13,20.32 122.17,20.32 122.17,22.86
  pour Bottom (no thermals): 119.13,33.78 119.13,31.24 122.17,31.24 122.17,33.78
  pour Bottom (no thermals): 16,42.93 16,40.39 19.05,40.39 19.05,42.93
IMEAS_12V_EE  (via drill 0.38)
  Top 0.254: U$5.7 87.45,16.84 88.14,17.53 103.12,17.53 v103.63,18.03 | v104.14,41.4 104.9,42.16 106.68,42.16 107.7,43.18 111.76,43.18 U$1.PE2
  Bottom 0.254: v103.63,18.03 103.89,18.29 103.89,41.15 v104.14,41.4
IMEAS_12V_MAIN  (via drill 0.38)
  Top 0.254: U$4.7 36.02,20.52 36.83,21.34 43.18,21.34 v44.2,20.32
  Bottom 0.254: 44.96,21.08 v44.2,20.32 47.24,23.37 47.24,40.64 48.01,41.4 48.01,42.16 48.51,42.67 51.05,42.67 51.56,43.18 53.34,43.18 U$1.PB4
N$1
  Top 0.254: LED_XB_RX.A RES_LEDXBRX.2
N$2
  Top 0.254: RES_LEDXBTX.2 LED_XB_TX.A
N$3
  Top 0.254: LED_DYNASWD.C 113.3,25.63 RES_LEDDYNASWD.2
N$4  (via drill 0.38)
  Top 0.254: LED_12V.C 8.46,1.02 v8.64,1.02
  Bottom 0.254: v8.64,1.02 8.09,1.56 RES_LEDPWR2.2
N$5  (via drill 0.38)
  Top 0.254: LED_12VU.C 5.16,1.02 v5.33,1.02
  Bottom 0.254: v5.33,1.02 4.79,1.56 RES_LEDPWR.2
N$6  (via drill 0.38)
  Top 0.254: LED_5V.C 1.98,1.02 v2.03,1.02
  Bottom 0.254: v2.03,1.02 1.74,1.56 RES_LEDPWR1.2
N$7  (via drill 0.38)
  Top 0.254: LED_12V1.C v15.75,4.83
  Bottom 0.254: v15.75,4.83 RES_LEDPWR4.2
N$10
  pour Top (no thermals): 88.52,11.68 92.2,11.68 95,14.73 98.55,14.73 99.69,13.59 99.69,10.54 98.23,9.08 88.52,9.08
N$11
  Bottom 0.254: RES_LEDPWR3.1 73.3,4.44 LED_5V1.A
N$12  (via drill 0.38)
  Top 0.254: v16.76,46.23 16.76,45.07 LED_12V2.C
  Bottom 0.254: RES_LEDPWR5.2 16.68,46.14 v16.76,46.23
N$13
  Bottom 0.254: R1.2 30.23,36.45 J2_DATA.P$1
N$14  (via drill 0.38)
  Top 0.254: LED_12V3.C 120.03,36.95 v119.89,37.08
  Bottom 0.254: v119.89,37.08 119.89,35.73 RES_LEDPWR6.2
N$15  (via drill 0.38)
  Top 0.254: v119.63,11.43 119.52,11.54 LED_12V4.C
  Bottom 0.254: RES_LEDPWR7.2 119.55,11.52 v119.63,11.43
RC3_TO_J2
  Top 0.254: J2_DATA.P$2 31.77,40.89 34.54,40.89 36.83,43.18 45.21,43.18 45.72,43.69 45.72,45.72 U$1.PD5
RX_FROM_J2_TTL
  Bottom 0.254: U$1.PA4 39.12,44.45 37.85,43.18 35.81,43.18 34.8,44.2 32.77,44.2 31.75,43.18 31.75,37.92 J2_DATA.P$4
RX_FROM_XB  (via drill 0.38)
  Top 0.254: LED_XB_RX.C 64.5,41.64 65.02,42.16 65.02,43.57 U$2.2 66.22,44.96 v61.21,44.96
  Bottom 0.254: U$1.PP0 55.63,45.97 60.2,45.97 v61.21,44.96
SIG_DYNA1  (via drill 0.38)
  Top 0.254: LT1910-DYNA1.4 45.21,30.99 v45.47,31.24
  Bottom 0.254: v45.47,31.24 45.72,31.5 45.72,40.39 46.23,40.89 46.74,40.89 47.5,41.66 47.5,42.42 48.26,43.18 50.8,43.18 U$1.PB5
SIG_DYNA2  (via drill 0.38)
  Top 0.254: v115.06,38.61 116.77,38.61 LT1910-DYNA2.4
  Bottom 0.254: U$1.PE1 115.57,39.12 v115.06,38.61
SIG_DYNA3
  Top 0.254: U$1.PF3 118.11,10.16 118.62,10.67 118.62,14.73 118.11,15.24 LT1910-DYNA3.4
SIG_EE  (via drill 0.38)
  Top 0.254: LT1910-EE.4 83.94,19.43 v84.58,20.07 | v85.09,4.32 85.34,4.57 99.57,4.57 U$1.PL3
  Bottom 0.254: v84.58,20.07 84.58,4.83 v85.09,4.32
SIG_J2  (via drill 0.38)
  Top 0.254: LT1910-J2.4 49.66,13.34 50.55,12.45 50.55,9.65 v50.8,9.4
  Bottom 0.254: v50.8,9.4 50.55,9.14 50.55,5.33 U$1.PM0
SIG_MAIN  (via drill 0.38)
  Top 0.254: v22.35,7.37 22.35,10.16 25.15,12.95 26.92,12.95 27.18,13.21 27.18,14.42 LT1910-MAIN.4
  Bottom 0.254: U$1.PK7 25.91,3.81 v22.35,7.37
SOURCE-DYNA1
  Top 0.254: LED_12V2.A 18.4,44.08 19.3,43.18 19.3,40.81 DYNA1.VCC
  pour Top (no thermals): 32,27.94 32,31.5 21.08,31.5 19.3,33.27 19.3,39.62 18.54,40.39 16.51,40.39 16,39.88 16,31.5 18.8,28.7 28.19,28.7 28.96,27.94
SOURCE-DYNA2
  Top 0.254: DYNA2.VCC 121.58,29.89 122.17,30.48 122.17,35.17 LED_12V3.A
  pour Top (no thermals): 115.82,31.24 115.82,28.38 117.73,28.38 117.73,31.24
  pour Top (no thermals): 115.82,28.38 120.78,28.38 121.6,29.21 121.6,30.48 120.84,31.24 115.82,31.24
SOURCE-DYNA3
  Top 0.254: DYNA3.VCC 121.88,19.09 122.17,18.8 122.17,14.11 LED_12V4.A
  pour Top (no thermals): 115.82,20.45 115.82,17.59 117.79,17.59 117.79,20.45
  pour Top (no thermals): 120.84,17.59 121.67,18.41 121.67,19.62 120.84,20.45 115.82,20.45 115.82,17.59
SOURCE-EE
  pour Top (no thermals): 82.74,8.76 87.69,8.76 87.69,11.75 82.74,11.75
SOURCE-J2
  Top 0.254: LED_12V1.A 21.97,4.83 J2_12V.P$2
  pour Top (no thermals): 26.29,12.95 32.07,12.95 32.13,9.59 32.13,9.4 30.67,9.4 27.62,6.35 24.77,6.35 23.5,7.62 23.5,10.16
SOURCE-MAIN
  pour Top (no thermals): 30.54,17.14 29.15,15.75 29.02,15.75 29.02,13.65 29.08,13.72 36.2,13.72 36.26,13.78 36.26,17.14
TO_TIVA_RESET  (via drill 0.38)  (1 unrouted)
  Top 0.254: U$1.RST1 50.8,2.54 61.59,2.54 U$8.P$2 64.85,4.06 71.12,4.06 72.14,3.05 v75.69,3.05
  Bottom 0.254: LED_5V1.C 76.18,3.53 v75.69,3.05
TX_TO_DYNA1  (via drill 0.38)
  Top 0.254: v20.57,35.81 24.13,32.26 34.8,32.26 35.81,33.27 43.69,33.27 v43.94,33.53
  Bottom 0.254: U$1.PK0 U$1.PK1 46.99,41.91 46.48,41.4 45.97,41.4 45.21,40.64 45.21,34.29 44.45,33.53 v43.94,33.53 | DYNA1.DATA 19.61,36.78 v20.57,35.81
TX_TO_DYNA23
  Top 0.254: RES_LEDDYNASWD.1 118.92,25.65 DYNA2.DATA
  Bottom 0.254: U$1.PC5 U$1.PC4 119.38,45.72 121.41,45.72 121.92,45.21 121.92,43.43 123.19,42.16 123.19,29.93 DYNA2.DATA 122.94,25.1 122.94,18.88 DYNA3.DATA
TX_TO_J2_TTL
  Top 0.254: U$1.PA5 35.31,44.45 35.05,44.2 30.99,44.2 30.23,43.43 30.23,42.44 J2_DATA.P$3
TX_TO_XB  (via drill 0.38)
  Top 0.254: U$2.3 63.13,42.67 v60.45,42.67 59.69,41.91 LED_XB_TX.C
  Bottom 0.254: U$1.PP1 53.34,45.72 55.12,45.72 55.37,45.47 58.17,45.47 58.42,45.21 58.42,43.43 59.18,42.67 v60.45,42.67

### Text on the board
tPlace: CUT ALONG DOTTED LINE | Mars Rover Design Team / Robotic Arm Rev 3 / Mike Miles | 2016 | 12VU | 12V | 5V